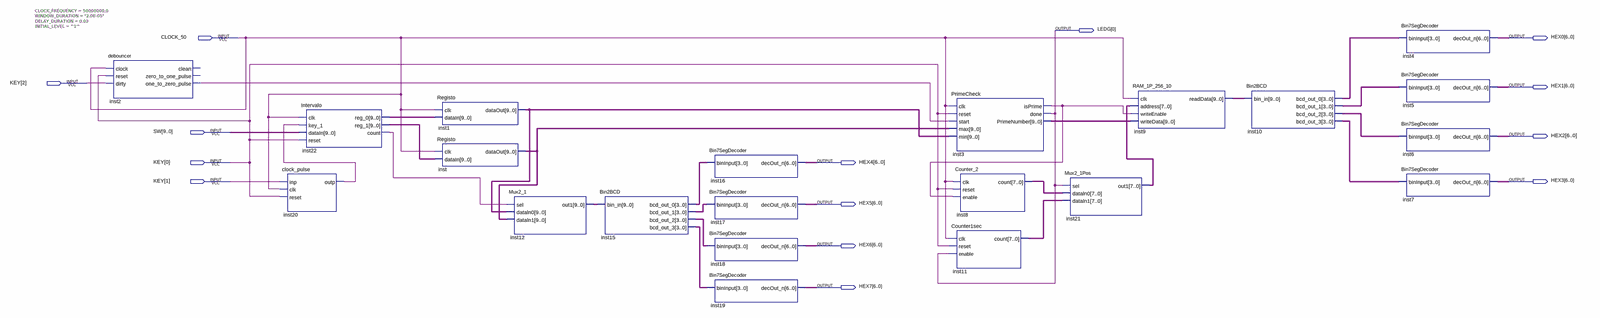
[diagram p0: schematic sheet, whole]
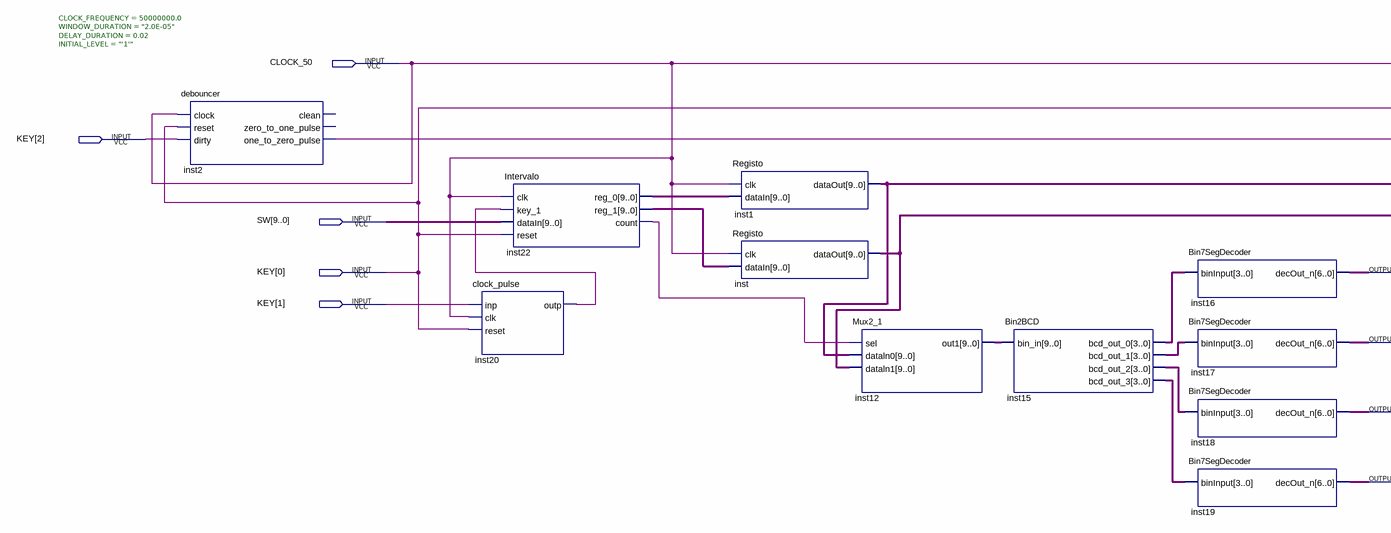
[diagram p1: schematic sheet, left part]
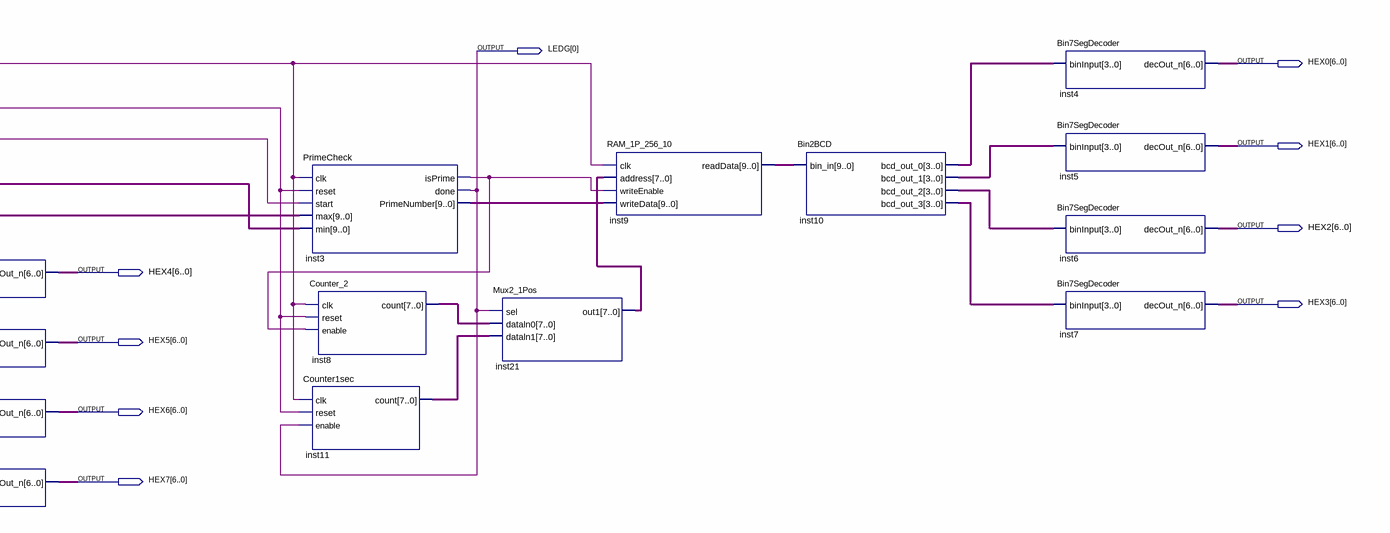
[diagram p2: schematic sheet, right part]
// Quartus schematic PrimeNumberGenerator.bdf as structural Verilog: 21 symbols, 14 pins
module PrimeNumberGenerator (
  input  CLOCK_50,
  input  [2:0] KEY,
  input  [9:0] SW,
  output [0:0] LEDG,
  output [6:0] HEX0,
  output [6:0] HEX1,
  output [6:0] HEX2,
  output [6:0] HEX4,
  output [6:0] HEX3,
  output [6:0] HEX5,
  output [6:0] HEX6,
  output [6:0] HEX7
);

  wire inst2_one_to_zero_pulse, inst3_isprime, inst20_outp, inst22_count;
  wire [3:0] inst10_bcd_out_0, inst10_bcd_out_1, inst10_bcd_out_2, inst10_bcd_out_3, inst15_bcd_out_0,
       inst15_bcd_out_1, inst15_bcd_out_2, inst15_bcd_out_3;
  wire [7:0] inst8_count, inst11_count, inst21_out1;
  wire [9:0] inst1_dataout, inst3_primenumber, inst9_readdata, inst12_out1, inst22_reg_0, inst22_reg_1,
       inst_dataout;

  debouncer #(.CLOCK_FREQUENCY(50000000.0), .WINDOW_DURATION("2.0E-05"), .DELAY_DURATION(0.02), .INITIAL_LEVEL("'1'")) inst2 (
    .clock(CLOCK_50), .reset(KEY[0]), .dirty(KEY[2]), .one_to_zero_pulse(inst2_one_to_zero_pulse));  // open: clean, zero_to_one_pulse
  clock_pulse inst20 (.inp(KEY[1]), .clk(CLOCK_50), .reset(KEY[0]), .outp(inst20_outp));
  Intervalo inst22 (
    .clk(CLOCK_50), .key_1(inst20_outp), .dataIn(SW), .reset(KEY[0]), .reg_0(inst22_reg_0),
    .reg_1(inst22_reg_1), .count(inst22_count));
  Registo inst1 (.clk(CLOCK_50), .dataIn(inst22_reg_0), .dataOut(inst1_dataout));
  Registo inst (.clk(CLOCK_50), .dataIn(inst22_reg_1), .dataOut(inst_dataout));
  Mux2_1 inst12 (.sel(inst22_count), .dataln0(inst1_dataout), .dataln1(inst_dataout), .out1(inst12_out1));
  Bin2BCD inst15 (
    .bin_in(inst12_out1), .bcd_out_0(inst15_bcd_out_0), .bcd_out_1(inst15_bcd_out_1),
    .bcd_out_2(inst15_bcd_out_2), .bcd_out_3(inst15_bcd_out_3));
  Bin7SegDecoder inst16 (.binInput(inst15_bcd_out_0), .decOut_n(HEX4));
  Bin7SegDecoder inst17 (.binInput(inst15_bcd_out_1), .decOut_n(HEX5));
  Bin7SegDecoder inst18 (.binInput(inst15_bcd_out_2), .decOut_n(HEX6));
  Bin7SegDecoder inst19 (.binInput(inst15_bcd_out_3), .decOut_n(HEX7));
  PrimeCheck inst3 (
    .clk(CLOCK_50), .reset(KEY[0]), .start(inst2_one_to_zero_pulse), .max(inst_dataout), .min(inst1_dataout),
    .isPrime(inst3_isprime), .done(LEDG[0]), .PrimeNumber(inst3_primenumber));
  Counter_2 inst8 (.clk(CLOCK_50), .reset(KEY[0]), .enable(inst3_isprime), .count(inst8_count));
  Counter1sec inst11 (.clk(CLOCK_50), .reset(KEY[0]), .enable(LEDG[0]), .count(inst11_count));
  Mux2_1Pos inst21 (.sel(LEDG[0]), .dataln0(inst8_count), .dataln1(inst11_count), .out1(inst21_out1));
  RAM_1P_256_10 inst9 (
    .clk(CLOCK_50), .address(inst21_out1), .writeEnable(inst3_isprime), .writeData(inst3_primenumber),
    .readData(inst9_readdata));
  Bin2BCD inst10 (
    .bin_in(inst9_readdata), .bcd_out_0(inst10_bcd_out_0), .bcd_out_1(inst10_bcd_out_1),
    .bcd_out_2(inst10_bcd_out_2), .bcd_out_3(inst10_bcd_out_3));
  Bin7SegDecoder inst4 (.binInput(inst10_bcd_out_0), .decOut_n(HEX0));
  Bin7SegDecoder inst5 (.binInput(inst10_bcd_out_1), .decOut_n(HEX1));
  Bin7SegDecoder inst6 (.binInput(inst10_bcd_out_2), .decOut_n(HEX2));
  Bin7SegDecoder inst7 (.binInput(inst10_bcd_out_3), .decOut_n(HEX3));
endmodule
